# Altium project 光阵列版.PrjPcb
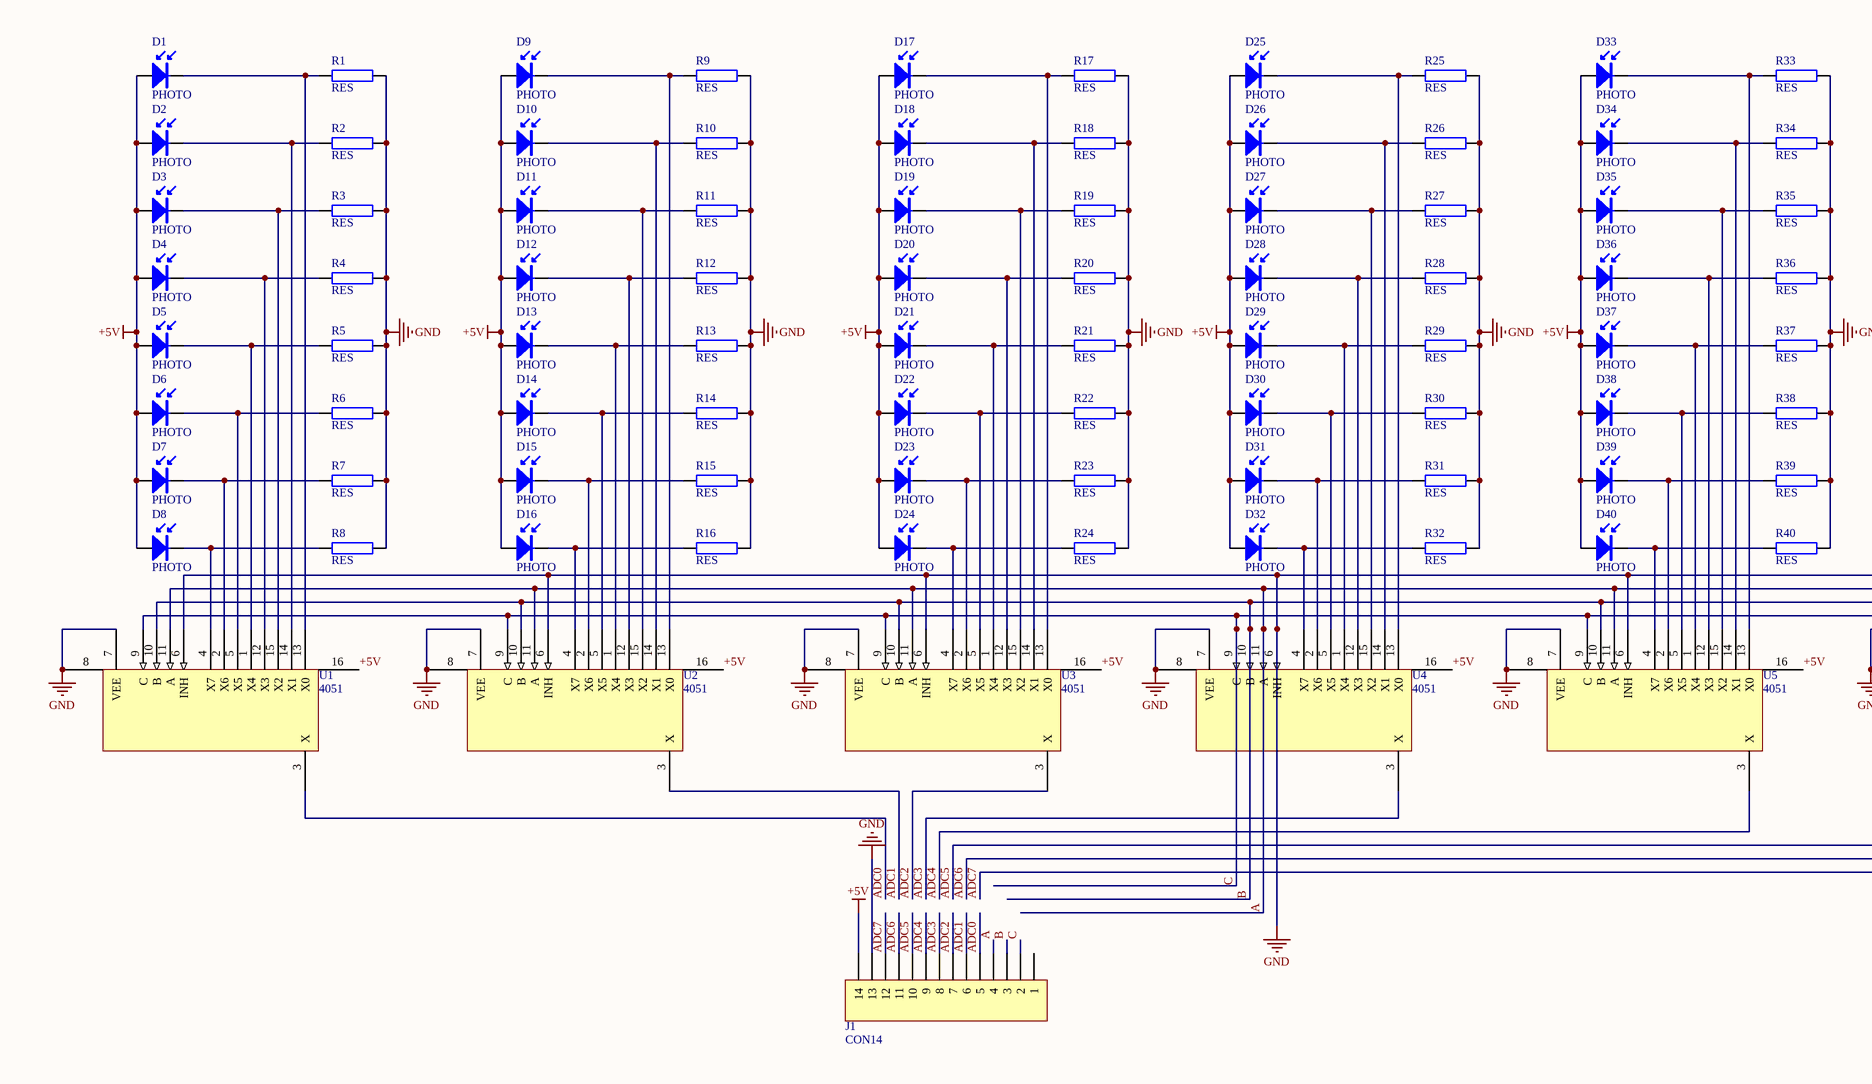
[diagram p0: 光阵列版.SchDoc, left]
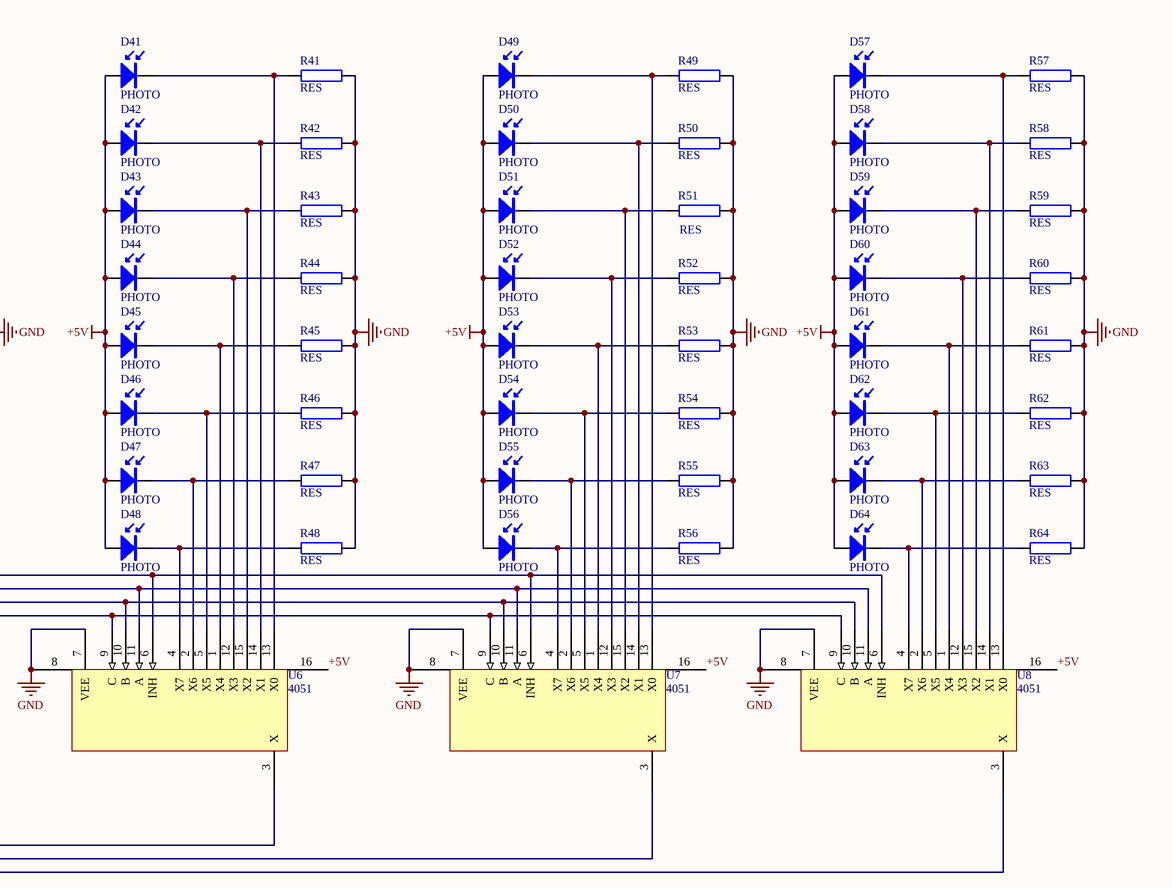
[diagram p1: 光阵列版.SchDoc, right]
1 sheet, 137 parts. Net scope: global (net labels, ports and power ports of the same name join across sheets).
Board file: 光阵列板.PcbDoc

## Sheet 光阵列版.SchDoc
size A1

### Parts
D1  PHOTO  [LED2]
D2  PHOTO  [LED2]
D3  PHOTO  [LED2]
D4  PHOTO  [LED2]
D5  PHOTO  [LED2]
D6  PHOTO  [LED2]
D7  PHOTO  [LED2]
D8  PHOTO  [LED2]
D9  PHOTO  [LED2]
D10  PHOTO  [LED2]
D11  PHOTO  [LED2]
D12  PHOTO  [LED2]
D13  PHOTO  [LED2]
D14  PHOTO  [LED2]
D15  PHOTO  [LED2]
D16  PHOTO  [LED2]
D17  PHOTO  [LED2]
D18  PHOTO  [LED2]
D19  PHOTO  [LED2]
D20  PHOTO  [LED2]
D21  PHOTO  [LED2]
D22  PHOTO  [LED2]
D23  PHOTO  [LED2]
D24  PHOTO  [LED2]
D25  PHOTO  [LED2]
D26  PHOTO  [LED2]
D27  PHOTO  [LED2]
D28  PHOTO  [LED2]
D29  PHOTO  [LED2]
D30  PHOTO  [LED2]
D31  PHOTO  [LED2]
D32  PHOTO  [LED2]
D33  PHOTO  [LED2]
D34  PHOTO  [LED2]
D35  PHOTO  [LED2]
D36  PHOTO  [LED2]
D37  PHOTO  [LED2]
D38  PHOTO  [LED2]
D39  PHOTO  [LED2]
D40  PHOTO  [LED2]
D41  PHOTO  [LED2]
D42  PHOTO  [LED2]
D43  PHOTO  [LED2]
D44  PHOTO  [LED2]
D45  PHOTO  [LED2]
D46  PHOTO  [LED2]
D47  PHOTO  [LED2]
D48  PHOTO  [LED2]
D49  PHOTO  [LED2]
D50  PHOTO  [LED2]
D51  PHOTO  [LED2]
D52  PHOTO  [LED2]
D53  PHOTO  [LED2]
D54  PHOTO  [LED2]
D55  PHOTO  [LED2]
D56  PHOTO  [LED2]
D57  PHOTO  [LED2]
D58  PHOTO  [LED2]
D59  PHOTO  [LED2]
D60  PHOTO  [LED2]
D61  PHOTO  [LED2]
D62  PHOTO  [LED2]
D63  PHOTO  [LED2]
D64  PHOTO  [LED2]
J1  CON14  [sip-14]
R1  RES  [AXIAL0.3]
R2  RES  [AXIAL0.3]
R3  RES  [AXIAL0.3]
R4  RES  [AXIAL0.3]
R5  RES  [AXIAL0.3]
R6  RES  [AXIAL0.3]
R7  RES  [AXIAL0.3]
R8  RES  [AXIAL0.3]
R9  RES  [AXIAL0.3]
R10  RES  [AXIAL0.3]
R11  RES  [AXIAL0.3]
R12  RES  [AXIAL0.3]
R13  RES  [AXIAL0.3]
R14  RES  [AXIAL0.3]
R15  RES  [AXIAL0.3]
R16  RES  [AXIAL0.3]
R17  RES  [AXIAL0.3]
R18  RES  [AXIAL0.3]
R19  RES  [AXIAL0.3]
R20  RES  [AXIAL0.3]
R21  RES  [AXIAL0.3]
R22  RES  [AXIAL0.3]
R23  RES  [AXIAL0.3]
R24  RES  [AXIAL0.3]
R25  RES  [AXIAL0.3]
R26  RES  [AXIAL0.3]
R27  RES  [AXIAL0.3]
R28  RES  [AXIAL0.3]
R29  RES  [AXIAL0.3]
R30  RES  [AXIAL0.3]
R31  RES  [AXIAL0.3]
R32  RES  [AXIAL0.3]
R33  RES  [AXIAL0.3]
R34  RES  [AXIAL0.3]
R35  RES  [AXIAL0.3]
R36  RES  [AXIAL0.3]
R37  RES  [AXIAL0.3]
R38  RES  [AXIAL0.3]
R39  RES  [AXIAL0.3]
R40  RES  [AXIAL0.3]
R41  RES  [AXIAL0.3]
R42  RES  [AXIAL0.3]
R43  RES  [AXIAL0.3]
R44  RES  [AXIAL0.3]
R45  RES  [AXIAL0.3]
R46  RES  [AXIAL0.3]
R47  RES  [AXIAL0.3]
R48  RES  [AXIAL0.3]
R49  RES  [AXIAL0.3]
R50  RES  [AXIAL0.3]
R51  RES  [AXIAL0.3]
R52  RES  [AXIAL0.3]
R53  RES  [AXIAL0.3]
R54  RES  [AXIAL0.3]
R55  RES  [AXIAL0.3]
R56  RES  [AXIAL0.3]
R57  RES  [AXIAL0.3]
R58  RES  [AXIAL0.3]
R59  RES  [AXIAL0.3]
R60  RES  [AXIAL0.3]
R61  RES  [AXIAL0.3]
R62  RES  [AXIAL0.3]
R63  RES  [AXIAL0.3]
R64  RES  [AXIAL0.3]
U1  4051  [SO-16]
U2  4051  [SO-16]
U3  4051  [SO-16]
U4  4051  [SO-16]
U5  4051  [SO-16]
U6  4051  [SO-16]
U7  4051  [SO-16]
U8  4051  [SO-16]

### Nets
+5V: D1.1 D2.1 D3.1 D4.1 D5.1 D6.1 D7.1 D8.1 D9.1 D10.1 D11.1 D12.1 D13.1 D14.1 D15.1 D16.1 D17.1 D18.1 D19.1 D20.1 D21.1 D22.1 D23.1 D24.1 D25.1 D26.1 D27.1 D28.1 D29.1 D30.1 D31.1 D32.1 D33.1 D34.1 D35.1 D36.1 D37.1 D38.1 D39.1 D40.1 D41.1 D42.1 D43.1 D44.1 D45.1 D46.1 D47.1 D48.1 D49.1 D50.1 D51.1 D52.1 D53.1 D54.1 D55.1 D56.1 D57.1 D58.1 D59.1 D60.1 D61.1 D62.1 D63.1 D64.1 J1.14 U1.16(VCC) U2.16(VCC) U3.16(VCC) U4.16(VCC) U5.16(VCC) U6.16(VCC) U7.16(VCC) U8.16(VCC)
GND: J1.13 R1.2 R2.2 R3.2 R4.2 R5.2 R6.2 R7.2 R8.2 R9.2 R10.2 R11.2 R12.2 R13.2 R14.2 R15.2 R16.2 R17.2 R18.2 R19.2 R20.2 R21.2 R22.2 R23.2 R24.2 R25.2 R26.2 R27.2 R28.2 R29.2 R30.2 R31.2 R32.2 R33.2 R34.2 R35.2 R36.2 R37.2 R38.2 R39.2 R40.2 R41.2 R42.2 R43.2 R44.2 R45.2 R46.2 R47.2 R48.2 R49.2 R50.2 R51.2 R52.2 R53.2 R54.2 R55.2 R56.2 R57.2 R58.2 R59.2 R60.2 R61.2 R62.2 R63.2 R64.2 U1.6(INH) U1.7(VEE) U1.8(GND) U2.6(INH) U2.7(VEE) U2.8(GND) U3.6(INH) U3.7(VEE) U3.8(GND) U4.6(INH) U4.7(VEE) U4.8(GND) U5.6(INH) U5.7(VEE) U5.8(GND) U6.6(INH) U6.7(VEE) U6.8(GND) U7.6(INH) U7.7(VEE) U7.8(GND) U8.6(INH) U8.7(VEE) U8.8(GND)
A: J1.4 U1.11(A) U2.11(A) U3.11(A) U4.11(A) U5.11(A) U6.11(A) U7.11(A) U8.11(A)
ADC0: J1.5 U1.3(X)
ADC1: J1.6 U2.3(X)
ADC2: J1.7 U3.3(X)
ADC3: J1.8 U4.3(X)
ADC4: J1.9 U5.3(X)
ADC5: J1.10 U6.3(X)
ADC6: J1.11 U7.3(X)
ADC7: J1.12 U8.3(X)
B: J1.3 U1.10(B) U2.10(B) U3.10(B) U4.10(B) U5.10(B) U6.10(B) U7.10(B) U8.10(B)
C: J1.2 U1.9(C) U2.9(C) U3.9(C) U4.9(C) U5.9(C) U6.9(C) U7.9(C) U8.9(C)
NetD1_2: D1.2 R1.1 U1.13(X0)
NetD2_2: D2.2 R2.1 U1.14(X1)
NetD3_2: D3.2 R3.1 U1.15(X2)
NetD4_2: D4.2 R4.1 U1.12(X3)
NetD5_2: D5.2 R5.1 U1.1(X4)
NetD6_2: D6.2 R6.1 U1.5(X5)
NetD7_2: D7.2 R7.1 U1.2(X6)
NetD8_2: D8.2 R8.1 U1.4(X7)
NetD9_2: D9.2 R9.1 U2.13(X0)
NetD10_2: D10.2 R10.1 U2.14(X1)
NetD11_2: D11.2 R11.1 U2.15(X2)
NetD12_2: D12.2 R12.1 U2.12(X3)
NetD13_2: D13.2 R13.1 U2.1(X4)
NetD14_2: D14.2 R14.1 U2.5(X5)
NetD15_2: D15.2 R15.1 U2.2(X6)
NetD16_2: D16.2 R16.1 U2.4(X7)
NetD17_2: D17.2 R17.1 U3.13(X0)
NetD18_2: D18.2 R18.1 U3.14(X1)
NetD19_2: D19.2 R19.1 U3.15(X2)
NetD20_2: D20.2 R20.1 U3.12(X3)
NetD21_2: D21.2 R21.1 U3.1(X4)
NetD22_2: D22.2 R22.1 U3.5(X5)
NetD23_2: D23.2 R23.1 U3.2(X6)
NetD24_2: D24.2 R24.1 U3.4(X7)
NetD25_2: D25.2 R25.1 U4.13(X0)
NetD26_2: D26.2 R26.1 U4.14(X1)
NetD27_2: D27.2 R27.1 U4.15(X2)
NetD28_2: D28.2 R28.1 U4.12(X3)
NetD29_2: D29.2 R29.1 U4.1(X4)
NetD30_2: D30.2 R30.1 U4.5(X5)
NetD31_2: D31.2 R31.1 U4.2(X6)
NetD32_2: D32.2 R32.1 U4.4(X7)
NetD33_2: D33.2 R33.1 U5.13(X0)
NetD34_2: D34.2 R34.1 U5.14(X1)
NetD35_2: D35.2 R35.1 U5.15(X2)
NetD36_2: D36.2 R36.1 U5.12(X3)
NetD37_2: D37.2 R37.1 U5.1(X4)
NetD38_2: D38.2 R38.1 U5.5(X5)
NetD39_2: D39.2 R39.1 U5.2(X6)
NetD40_2: D40.2 R40.1 U5.4(X7)
NetD41_2: D41.2 R41.1 U6.13(X0)
NetD42_2: D42.2 R42.1 U6.14(X1)
NetD43_2: D43.2 R43.1 U6.15(X2)
NetD44_2: D44.2 R44.1 U6.12(X3)
NetD45_2: D45.2 R45.1 U6.1(X4)
NetD46_2: D46.2 R46.1 U6.5(X5)
NetD47_2: D47.2 R47.1 U6.2(X6)
NetD48_2: D48.2 R48.1 U6.4(X7)
NetD49_2: D49.2 R49.1 U7.13(X0)
NetD50_2: D50.2 R50.1 U7.14(X1)
NetD51_2: D51.2 R51.1 U7.15(X2)
NetD52_2: D52.2 R52.1 U7.12(X3)
NetD53_2: D53.2 R53.1 U7.1(X4)
NetD54_2: D54.2 R54.1 U7.5(X5)
NetD55_2: D55.2 R55.1 U7.2(X6)
NetD56_2: D56.2 R56.1 U7.4(X7)
NetD57_2: D57.2 R57.1 U8.13(X0)
NetD58_2: D58.2 R58.1 U8.14(X1)
NetD59_2: D59.2 R59.1 U8.15(X2)
NetD60_2: D60.2 R60.1 U8.12(X3)
NetD61_2: D61.2 R61.1 U8.1(X4)
NetD62_2: D62.2 R62.1 U8.5(X5)
NetD63_2: D63.2 R63.1 U8.2(X6)
NetD64_2: D64.2 R64.1 U8.4(X7)

Not connected (* = marked no-connect by the designer): J1 1

### Library data of the parts
D1-D64 = PHOTO: Photosensitive Diode
J1 = CON14: Connector